# Altium schematic sheet input_stage.SchDoc: Fine Delay FMC
size 297 x 209 mm; CheckedBy: B. Civel; CompanyName: CERN; DrawnBy: TW, GK; Engineer: TW; Organization: CERN; Address1: European Organization for Nuclear Research; Address2: CH-1211 Geneve 23 - Switzerland; DocumentNumber: 6; Revision: -; SheetNumber: 6; SheetTotal: 10; ModifiedBy: B. Civel; CreateDate: 19/01/2012; CheckedDate: 06/06/2013; Title2: Input stage logic; Designer: TW, GK; EDA_Number: EDA-02267-V6-1; Projet: Fine Delay FMC (FMCDel1ns4cha); DivGrp: BE-CO; ModifiedDate: 16/08/2012
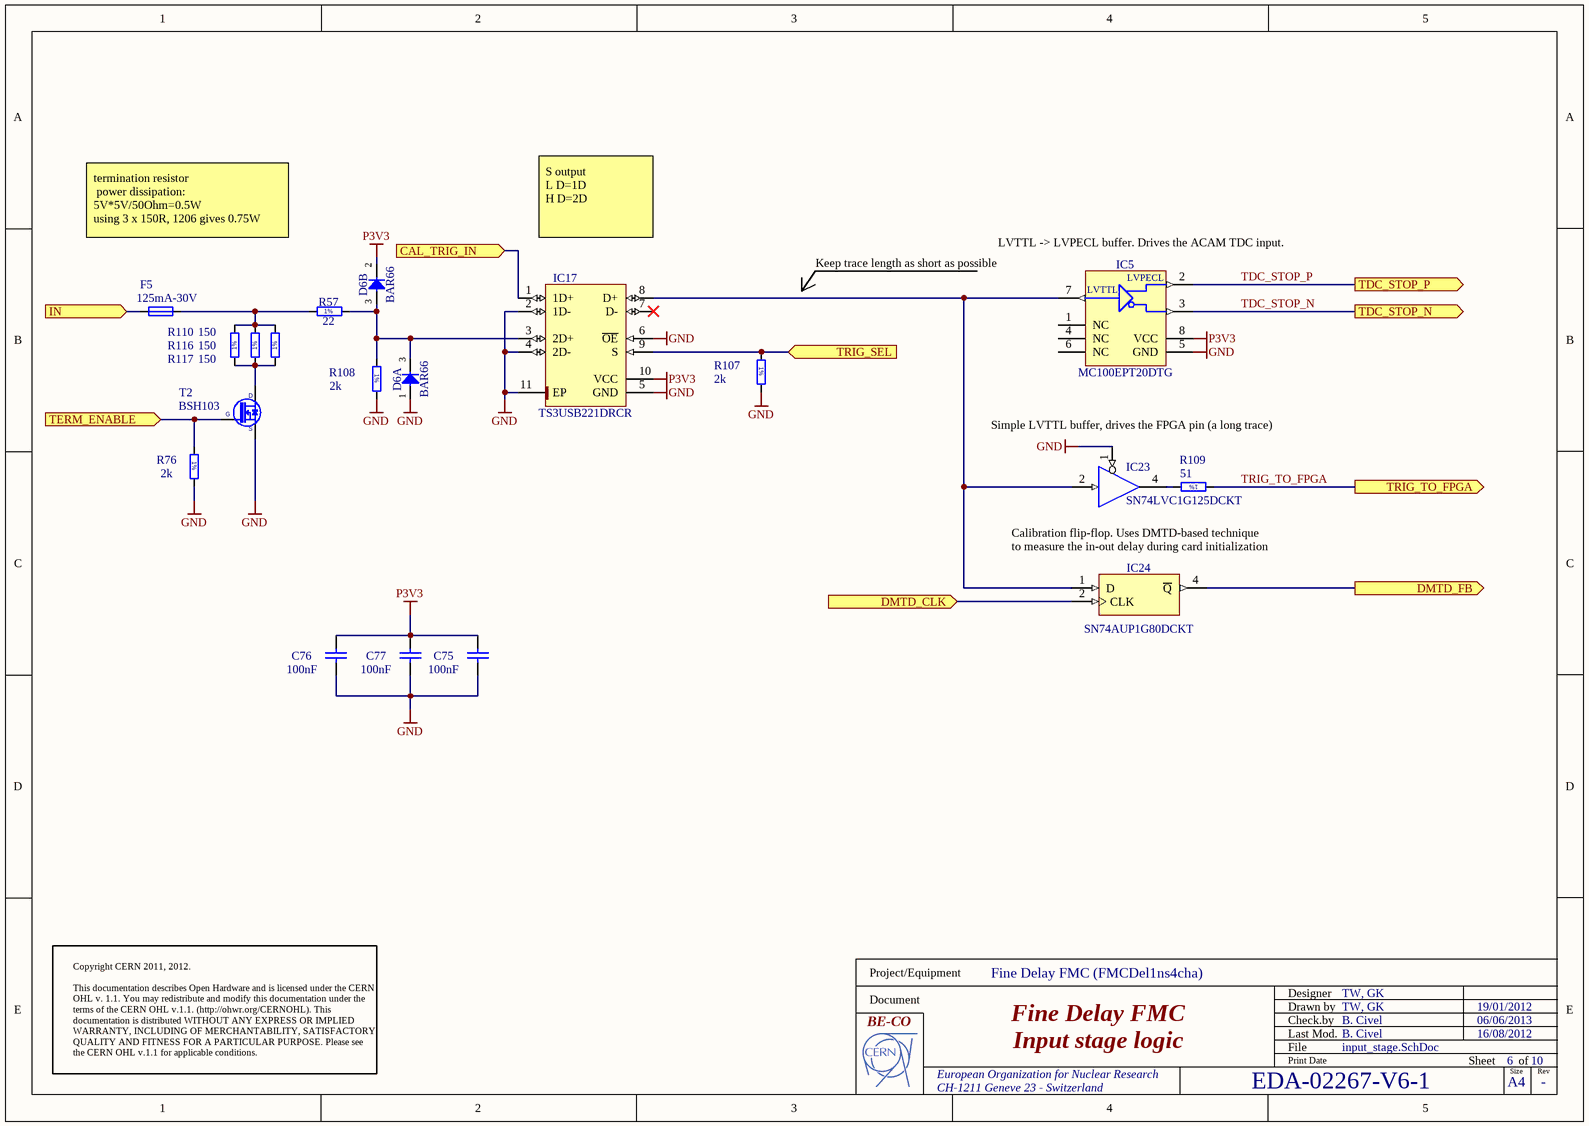
[diagram p0: input_stage.SchDoc]

## Parts
C75  100nF  [CAPC1608X87N]
C76  100nF  [CAPC1608X87N]
C77  100nF  [CAPC1608X87N]
D6  BAR66  [SOT95P240X110-3N]  (parts A,B of 2)
F5  125mA-30V  [FUSR_LITTELFUSE_1206L012]
IC5  MC100EPT20DTG  [SOP65P490X110-8N]
IC17  TS3USB221DRCR  [TEXAS_DRC (S-PVSON-N10)]
IC23  SN74LVC1G125DCKT  [SOT65P210X110-5N]
IC24  SN74AUP1G80DCKT  [SOT65P210X110-5N]
R57  22  [RESC1608X55N]
R76  2k  [RESC1608X55N]
R107  2k  [RESC1608X55N]
R108  2k  [RESC1608X55N]
R109  51  [RESC1608X55N]
R110  150  [RESC3216X65N]
R116  150  [RESC3216X65N]
R117  150  [RESC3216X65N]
T2  BSH103  [SOT95P230X110-3N]

## Ports
CAL_TRIG_IN (in), DMTD_CLK (in), DMTD_FB (out), IN (in), TDC_STOP_N (out), TDC_STOP_P (out), TERM_ENABLE (in), TRIG_SEL (in), TRIG_TO_FPGA (out)

## Nets
GND: C75.2 C76.2 C77.2 D6.1(A) IC5.5(GND) IC17.2(1D-) IC17.4(2D-) IC17.5(GND) IC17.6(~{OE}) IC17.11(EP) IC23.1(~{G}) IC23.3(GND) IC24.3(GND) R76.2 R107.2 R108.2 T2.2(S)
P3V3: C75.1 C76.1 C77.1 D6.2(C) IC5.8(VCC) IC17.10(VCC) IC23.5(VCC) IC24.5(VCC)
CAL_TRIG_IN: IC17.1(1D+) ; port CAL_TRIG_IN
DMTD_CLK: IC24.2(CLK) ; port DMTD_CLK
DMTD_FB: IC24.4(~{Q}) ; port DMTD_FB
IN: F5.1 ; port IN
TDC_STOP_N: IC5.3(~{Q}) ; port TDC_STOP_N
TDC_STOP_P: IC5.2(Q) ; port TDC_STOP_P
TERM_ENABLE: R76.1 T2.1(G) ; port TERM_ENABLE
TRIG_SEL: IC17.9(S) R107.1 ; port TRIG_SEL
TRIG_TO_FPGA: R109.1 ; port TRIG_TO_FPGA
NetD6_3: D6.3(COMAC) IC17.3(2D+) R57.2 R108.1
NetF5_2: F5.2 R57.1 R110.2 R116.2 R117.2
NetIC5_7: IC5.7(D) IC17.8(D+) IC23.2(IN) IC24.1(D)
NetIC23_4: IC23.4(OUT) R109.2
NetR110_1: R110.1 R116.1 R117.1 T2.3(D)

Not connected (* = marked no-connect by the designer): IC5 1(NC) 4(NC) 6(NC); IC17 7(D-)*

## Notes on the sheet
- termination resistor
  power dissipation:
  5V*5V/50Ohm=0.5W
  using 3 x 150R, 1206 gives 0.75W
- S	output
  L	D=1D
  H	D=2D
- (near IC5) Keep trace length as short as possible
- (near IC5) LVTTL -> LVPECL buffer. Drives the ACAM TDC input.
- Simple LVTTL buffer, drives the FPGA pin (a long trace)
- Calibration flip-flop. Uses DMTD-based technique
- to measure the in-out delay during card initialization
- Copyright CERN 2011, 2012.
  This documentation describes Open Hardware and is licensed under the CERN OHL v. 1.1. You may redistribute and modify this documentation under the terms of the CERN OHL v.1.1. (http://ohwr.org/CERNOHL). This documentation is distributed WITHOUT ANY EXPRESS OR IMPLIED WARRANTY, INCLUDING OF MERCHANTABILITY, SATISFACTORY QUALITY AND FITNESS FOR A PARTICULAR PURPOSE. Please see the CERN OHL v.1.1 for applicable conditions.
- Project/Equipment
- Document
- Designer
- Drawn by
- Check.by
- File
- Last Mod.
- Print Date
- Sheet
- Size
- A4
- of
- Rev
- (in symbol MC100EPT20DTG) LVPECL; LVTTL
- (in symbol R0603_2K_1%_0.1W_100PPM) 1%
- (in symbol R0603_22R_1%_0.1W_100PPM) 1%
- (in symbol R0603_51R_1%_0.1W_100PPM) 1%
- (in symbol R1206_150R_1%_0.25W_100PPM) 1%

## Library data of the parts
C75-C77 = CC0603_100NF_50V_10%_X7R: Non-polarised capacitor; Part Description: SMD Multilayer Chip Ceramic Capacitor; Manufacturer: GENERIC; Manufacturer1 Part Number: 223858615649; Voltage: 50V; TC: X7R; Tolerance: ±10%; Table: Capacitors SMD; Part Number: CC0603_100NF_50V_10%_X7R; Component Kind: Standard; Component Type: Standard; Pin Count: 2; Value: 100nF; Status: Preferred; Manufacturer Part Number: CC0603_100NF_50V_10%_X7R; Case: 0603; Mounted: Yes; Socket: No; SMD: Yes; Manufacturer1 Example: PHYCOMP; Manufacturer1 ComponentHeight: 0.87mm; HelpURL: \\cern.ch\dfs\Applications\Altium\Datasheets\CC0603_X7R_PHYCOMP.pdf; Author: CERN DEM JLC; CreateDate: 03/12/2007; LatestRevisionDate: 03/12/2007
D6 = BAR66: Serial Diode; Part Description: Silicon PIN Diode Array (Series Connected); Manufacturer: INFINEON; Voltage: 150V; Power: 250mA; Table: Diodes; PressFit: No; Bonding: No; Part Number: BAR66; Component Kind: Standard; Component Type: Standard; Device: BAR66; PackageDescription: SOT23 3-Leads, Pitch 0.95mm - Body 1.3x2.9mm, IPC Medium Density; Manufacturer Part Number: BAR66; Pin Count: 3; Case: SOT23; Mounted: Yes; Socket: No; SMD: Yes; ComponentHeight: 1.1mm; HelpURL: \\cern.ch\dfs\Applications\Altium\Datasheets\BAR66.pdf; Author: CERN DEM JLC; CreateDate: 18/01/2010; LatestRevisionDate: 05/10/2010
F5 = FUSR_LITTELFUSE_1206L012: Fuse; Part Description: POLYFUSE® Surface Mount Resettable PTC; Manufacturer Part Number: 1206L012WR; Table: Fuses; PressFit: No; Part Number: FUSR_LITTELFUSE_1206L012; Component Kind: Standard; Component Type: Standard; Pin Count: 2; PackageDescription: Surface Mount POLY-FUSE® Resettable PTC, 1206L Series; Family: Fuses Resettable; Mounted: Yes; Socket: No; SMD: Yes; Value: 125mA-30V; Manufacturer: LITTELFUSE; ComponentHeight: 1.45mm; HelpURL: \\cern.ch\dfs\Applications\Altium\Datasheets\FUSR_LITTELFUSE_1206L012.pdf; Author: CERN DEM JLC; CreateDate: 19/12/2011; LatestRevisionDate: 19/12/2011
IC5 = MC100EPT20DTG: 3.3V LVTTL/LVCMOS to Differential LVPECL Translator; Manufacturer: ON SEMICONDUCTOR; Table: Standard Logic; PressFit: No; Bonding: No; Part Number: MC100EPT20DTG; Component Kind: Standard; Component Type: Standard; Device: MC100EPT20DTG; PackageDescription: SOP, 0.65mm pitch; 8 pin, 3.00mm W X 3.00mm L X 1.10mm H body, IPC Medium Density; Part Description: 3.3V LVTTL/LVCMOS To Differential LVPECL Translator; Manufacturer Part Number: MC100EPT20DTG; Pin Count: 8; Case: SOIC8; Mounted: Yes; Socket: No; SMD: Yes; ComponentHeight: 1.1mm; Author: CERN DEM JLC; HelpURL: \\cern.ch\dfs\Applications\Altium\Datasheets\MC100EPT20DTG.pdf; CreateDate: 05/07/2010; LatestRevisionDate: 05/07/2010
IC17 = TS3USB221DRCR: High-Speed USB 2.0 (480-Mbps) 1:2 Multiplexer/Demultiplexer Switch With Single Enable; Manufacturer: TEXAS INSTRUMENTS; Table: Analog & Interface; PressFit: No; Bonding: No; Part Number: TS3USB221DRCR; Component Kind: Standard; Component Type: Standard; Device: TS3USB221DRCR; PackageDescription: SON, TEXAS DRC (S-PVSON-N10), 0.50mm Pitch, 10-pin, 3.00mm W  X 3.00mm L X 1.00mm Height, (w/thermal tab 1.65 X 2.40 mm); Part Description: High-Speed USB 2.0 (480-Mbps) 1:2 Multiplexer/Demultiplexer Switch With Single Enable; Manufacturer Part Number: TS3USB221DRCR; Pin Count: 11; Case: SON10; Mounted: Yes; Socket: No; SMD: Yes; ComponentHeight: 1mm; Author: CERN DEM JLC; HelpURL: \\cern.ch\dfs\Applications\Altium\Datasheets\TS3USB221DRCR.pdf; CreateDate: 25/08/2010; LatestRevisionDate: 06/11/2013
IC23 = SN74LVC1G125DCKT: Single Bus Buffer Gate With 3-State Output; Manufacturer: TEXAS INSTRUMENTS; Table: Standard Logic; PressFit: No; Bonding: No; Part Number: SN74LVC1G125DCKT; Component Kind: Standard; Component Type: Standard; Device: SN74LVC1G125DCKT; PackageDescription: SOT353, SC70-5, SOT, 0.65mm Pitch, 5 pin, 1.25mm W X 2.00mm L X 1.10mm H, IPC Medium Density; Part Description: Single Bus Buffer Gate With 3-State Output; Manufacturer Part Number: SN74LVC1G125DCKT; Pin Count: 5; Case: SOT353; Mounted: Yes; Socket: No; SMD: Yes; ComponentHeight: 1.1mm; Author: CERN DEM JLC; HelpURL: \\cern.ch\dfs\Applications\Altium\Datasheets\SN74LVC1G125DCKT.pdf; CreateDate: 19/12/2011; LatestRevisionDate: 19/12/2011
IC24 = SN74AUP1G80DCKT: Single Positive-Edge-Triggered D-Type Flip-Flop; Part Description: Low-Power Single Positive-Edge-Triggered D-Type Flip-Flop; Manufacturer: TEXAS INSTRUMENTS; Table: Standard Logic; PressFit: No; Bonding: No; Part Number: SN74AUP1G80DCKT; Component Kind: Standard; Component Type: Standard; Device: SN74AUP1G80DCKT; PackageDescription: SOT353, SC70-5, SOT, 0.65mm Pitch, 5 pin, 1.25mm W X 2.00mm L X 1.10mm H, IPC Medium Density; Manufacturer Part Number: SN74AUP1G80DCKT; Pin Count: 5; Case: SOT353; Mounted: Yes; Socket: No; SMD: Yes; ComponentHeight: 1.1mm; Author: CERN DEM JLC; HelpURL: \\cern.ch\dfs\Applications\Altium\Datasheets\SN74AUP1G80DCKT.pdf; CreateDate: 19/12/2011; LatestRevisionDate: 19/12/2011
R57 = R0603_22R_1%_0.1W_100PPM: Resistor - 1%; Part Description: General Purpose Thick Film Chip Resistor; Manufacturer: GENERIC; Manufacturer1 Part Number: NRC06F22R0TRF; Power: 0.1W; TC: ±100ppm/°C; Table: Resistors SMD; Part Number: R0603_22R_1%_0.1W_100PPM; Component Kind: Standard; Component Type: Standard; Pin Count: 2; Value: 22; Status: Preferred; Tolerance: ±1%; Manufacturer Part Number: R0603_22R_1%_0.1W_100PPM; Case: 0603; Mounted: Yes; Socket: No; SMD: Yes; Manufacturer1 Example: NIC COMPONENT; Manufacturer1 ComponentHeight: 0.55mm; HelpURL: \\cern.ch\dfs\Applications\Altium\Datasheets\R0603_NIC_NRC.pdf; Author: CERN DEM JLC; CreateDate: 03/12/2007; LatestRevisionDate: 13/03/2008
R76 R107 R108 = R0603_2K_1%_0.1W_100PPM: Resistor - 1%; Part Description: General Purpose Thick Film Chip Resistor; Manufacturer: GENERIC; Manufacturer1 Part Number: NRC06F2001TRF; Power: 0.1W; TC: ±100ppm/°C; Table: Resistors SMD; Part Number: R0603_2K_1%_0.1W_100PPM; Component Kind: Standard; Component Type: Standard; Pin Count: 2; Value: 2k; Status: Preferred; Tolerance: ±1%; Manufacturer Part Number: R0603_2K_1%_0.1W_100PPM; Case: 0603; Mounted: Yes; Socket: No; SMD: Yes; Manufacturer1 Example: NIC COMPONENT; Manufacturer1 ComponentHeight: 0.55mm; HelpURL: \\cern.ch\dfs\Applications\Altium\Datasheets\R0603_NIC_NRC.pdf; Author: CERN DEM JLC; CreateDate: 12/3/2007; LatestRevisionDate: 3/13/2008
R109 = R0603_51R_1%_0.1W_100PPM: Resistor - 1%; Part Description: General Purpose Thick Film Chip Resistor; Manufacturer: GENERIC; Manufacturer1 Part Number: NRC06F51R0TRF; Power: 0.1W; TC: ±100ppm/°C; Table: Resistors SMD; Part Number: R0603_51R_1%_0.1W_100PPM; Component Kind: Standard; Component Type: Standard; Pin Count: 2; Value: 51; Status: Preferred; Tolerance: ±1%; Manufacturer Part Number: R0603_51R_1%_0.1W_100PPM; Case: 0603; Mounted: Yes; Socket: No; SMD: Yes; Manufacturer1 Example: NIC COMPONENT; Manufacturer1 ComponentHeight: 0.55mm; HelpURL: \\cern.ch\dfs\Applications\Altium\Datasheets\R0603_NIC_NRC.pdf; Author: CERN DEM JLC; CreateDate: 12/3/2007; LatestRevisionDate: 3/13/2008
R110 R116 R117 = R1206_150R_1%_0.25W_100PPM: Resistor - 1%; Part Description: General Purpose Thick Film Chip Resistor; Manufacturer: GENERIC; Manufacturer1 Part Number: NRC12F1500TRF; Power: 0.25W; TC: ±100ppm/°C; Table: Resistors SMD; Part Number: R1206_150R_1%_0.25W_100PPM; Component Kind: Standard; Component Type: Standard; Pin Count: 2; Value: 150; Status: Preferred; Tolerance: ±1%; Manufacturer Part Number: R1206_150R_1%_0.25W_100PPM; Case: 1206; Mounted: Yes; Socket: No; SMD: Yes; Manufacturer1 Example: NIC COMPONENT; Manufacturer1 ComponentHeight: 0.65mm; HelpURL: \\cern.ch\dfs\Applications\Altium\Datasheets\R1206_NIC_NRC.pdf; Author: CERN DEM JLC; CreateDate: 12/3/2007; LatestRevisionDate: 3/13/2008
T2 = BSH103: N-CHANNEL MOSFET WITH DIODE; Part Description: 30V 850mA N-Channel Enhancement Mode Field-Effect Transistor; Manufacturer: NXP SEMICONDUCTORS; Table: Transistors; PressFit: No; Bonding: No; Part Number: BSH103; Component Kind: Standard; Component Type: Standard; Device: BSH103; PackageDescription: SOT23, 3 pin, Pitch 0.95mm - 1.3mm W X 2.9mm L X 1.1mm H, IPC Medium Density; Manufacturer Part Number: BSH103; Pin Count: 3; Case: SOT23-3; Mounted: Yes; Socket: No; SMD: Yes; ComponentHeight: 1.1mm; HelpURL: \\cern.ch\dfs\Applications\Altium\Datasheets\BSH103.pdf; Author: CERN DEM JLC; CreateDate: 16/03/2010; LatestRevisionDate: 01/02/2012